# EAGLE schematic DIDV_-_Expansao_05 (EAGLE 6.2)

## Sheet 1 of 2
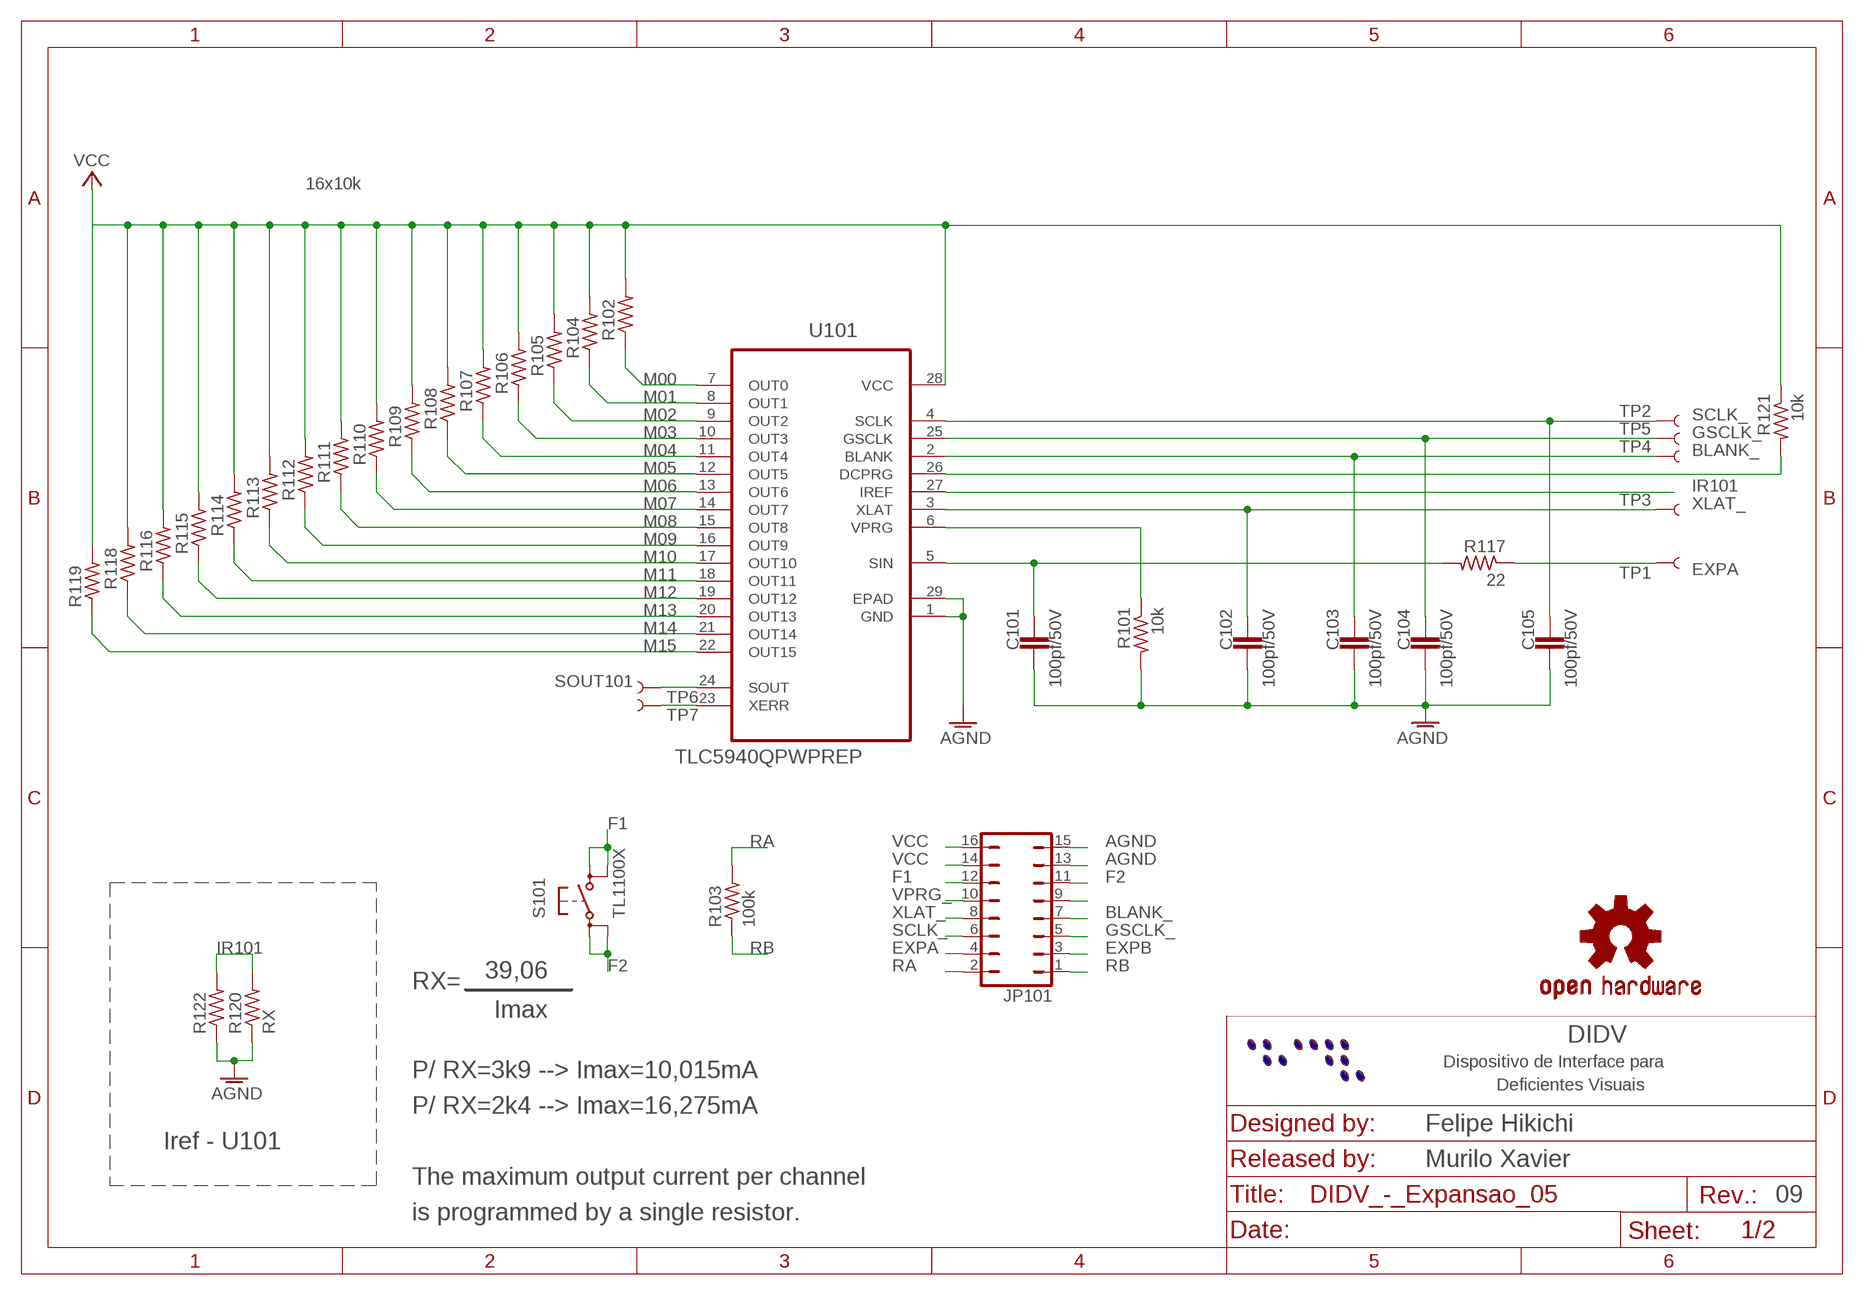
[diagram p0: schematic, sheet 1]

### Parts
C101  100pf/50V  C-EUC0603K  [C0603K]
C102  100pf/50V  C-EUC0603K  [C0603K]
C103  100pf/50V  C-EUC0603K  [C0603K]
C104  100pf/50V  C-EUC0603K  [C0603K]
C105  100pf/50V  C-EUC0603K  [C0603K]
JP101  JP8Q  [JP8Q]
LOGO101  OSHW-LOGOM  [OSHW-LOGO-M]
R101  10k  R-US_R0603  [R0603]
R102  R-US_R0805  [R0805]
R103  100k  R-US_R0805  [R0805]
R104  R-US_R0805  [R0805]
R105  R-US_R0805  [R0805]
R106  R-US_R0805  [R0805]
R107  R-US_R0805  [R0805]
R108  R-US_R0805  [R0805]
R109  R-US_R0805  [R0805]
R110  R-US_R0805  [R0805]
R111  R-US_R0805  [R0805]
R112  R-US_R0805  [R0805]
R113  R-US_R0805  [R0805]
R114  R-US_R0805  [R0805]
R115  R-US_R0805  [R0805]
R116  R-US_R0805  [R0805]
R117  22  R-US_R0603  [R0603]
R118  R-US_R0805  [R0805]
R119  R-US_R0805  [R0805]
R120  RX  R-US_R0805  [R0805]
R121  10k  R-US_R0603  [R0603]
R122  R-US_R0805  [R0805]
S101  TL1100X  [TL1100X]
TP1  TEST-POINT3X4  [PAD.03X.04]
TP2  TEST-POINT3X4  [PAD.03X.04]
TP3  TEST-POINT3X4  [PAD.03X.04]
TP4  TEST-POINT3X4  [PAD.03X.04]
TP5  TEST-POINT3X4  [PAD.03X.04]
TP6  TEST-POINT3X4  [PAD.03X.04]
TP7  TEST-POINT3X4  [PAD.03X.04]
U101  TLC5940QPWPREP  [SOP65P640X120-29N]

### Nets
AGND: C101.1 C102.1 C103.1 C104.1 C105.1 JP101.13 JP101.15 R101.2 R120.1 R122.1 U101.1(GND) U101.29(EPAD) ; also sheet 2
BLANK_: C103.2 JP101.7 TP4.P$1 U101.2(BLANK) ; also sheet 2
EXPA: JP101.4 R117.1 TP1.P$1
EXPB: JP101.3 ; also sheet 2
F1: JP101.12 S101.3(S) S101.4(S1)
F2: JP101.11 S101.1(P) S101.2(P1)
GSCLK_: C104.2 JP101.5 TP5.P$1 U101.25(GSCLK) ; also sheet 2
IR101: R120.2 R122.2 U101.27(IREF)
M00: R102.1 U101.7(OUT0) ; also sheet 2
M01: R104.1 U101.8(OUT1) ; also sheet 2
M02: R105.1 U101.9(OUT2) ; also sheet 2
M03: R106.1 U101.10(OUT3) ; also sheet 2
M04: R107.1 U101.11(OUT4) ; also sheet 2
M05: R108.1 U101.12(OUT5) ; also sheet 2
M06: R109.1 U101.13(OUT6) ; also sheet 2
M07: R110.1 U101.14(OUT7) ; also sheet 2
M08: R111.1 U101.15(OUT8) ; also sheet 2
M09: R112.1 U101.16(OUT9) ; also sheet 2
M10: R113.1 U101.17(OUT10) ; also sheet 2
M11: R114.1 U101.18(OUT11) ; also sheet 2
M12: R115.1 U101.19(OUT12) ; also sheet 2
M13: R116.1 U101.20(OUT13) ; also sheet 2
M14: R118.1 U101.21(OUT14) ; also sheet 2
M15: R119.1 U101.22(OUT15) ; also sheet 2
N$2: JP101.9
N$4: C101.2 R117.2 U101.5(SIN)
N$10: TP7.P$1 U101.23(XERR)
N$22: R121.2 U101.26(DCPRG)
RA: JP101.2 R103.2
RB: JP101.1 R103.1
SCLK_: C105.2 JP101.6 TP2.P$1 U101.4(SCLK) ; also sheet 2
SOUT101: TP6.P$1 U101.24(SOUT) ; also sheet 2
VCC: JP101.14 JP101.16 R102.2 R104.2 R105.2 R106.2 R107.2 R108.2 R109.2 R110.2 R111.2 R112.2 R113.2 R114.2 R115.2 R116.2 R118.2 R119.2 R121.1 U101.28(VCC) ; also sheet 2
VPRG_: JP101.10 R101.1 U101.6(VPRG) ; also sheet 2
XLAT_: C102.2 JP101.8 TP3.P$1 U101.3(XLAT) ; also sheet 2

### Notes on the sheet
- 16x10k
- 39,06
- RX=
- Imax
- DIDV
- Dispositivo de Interface para
- P/ RX=3k9 --> Imax=10,015mA
- Deficientes Visuais
- P/ RX=2k4 --> Imax=16,275mA
- Felipe Hikichi
- Iref - U101
- Murilo Xavier
- The maximum output current per channel
- 09
- is programmed by a single resistor.

## Sheet 2 of 2
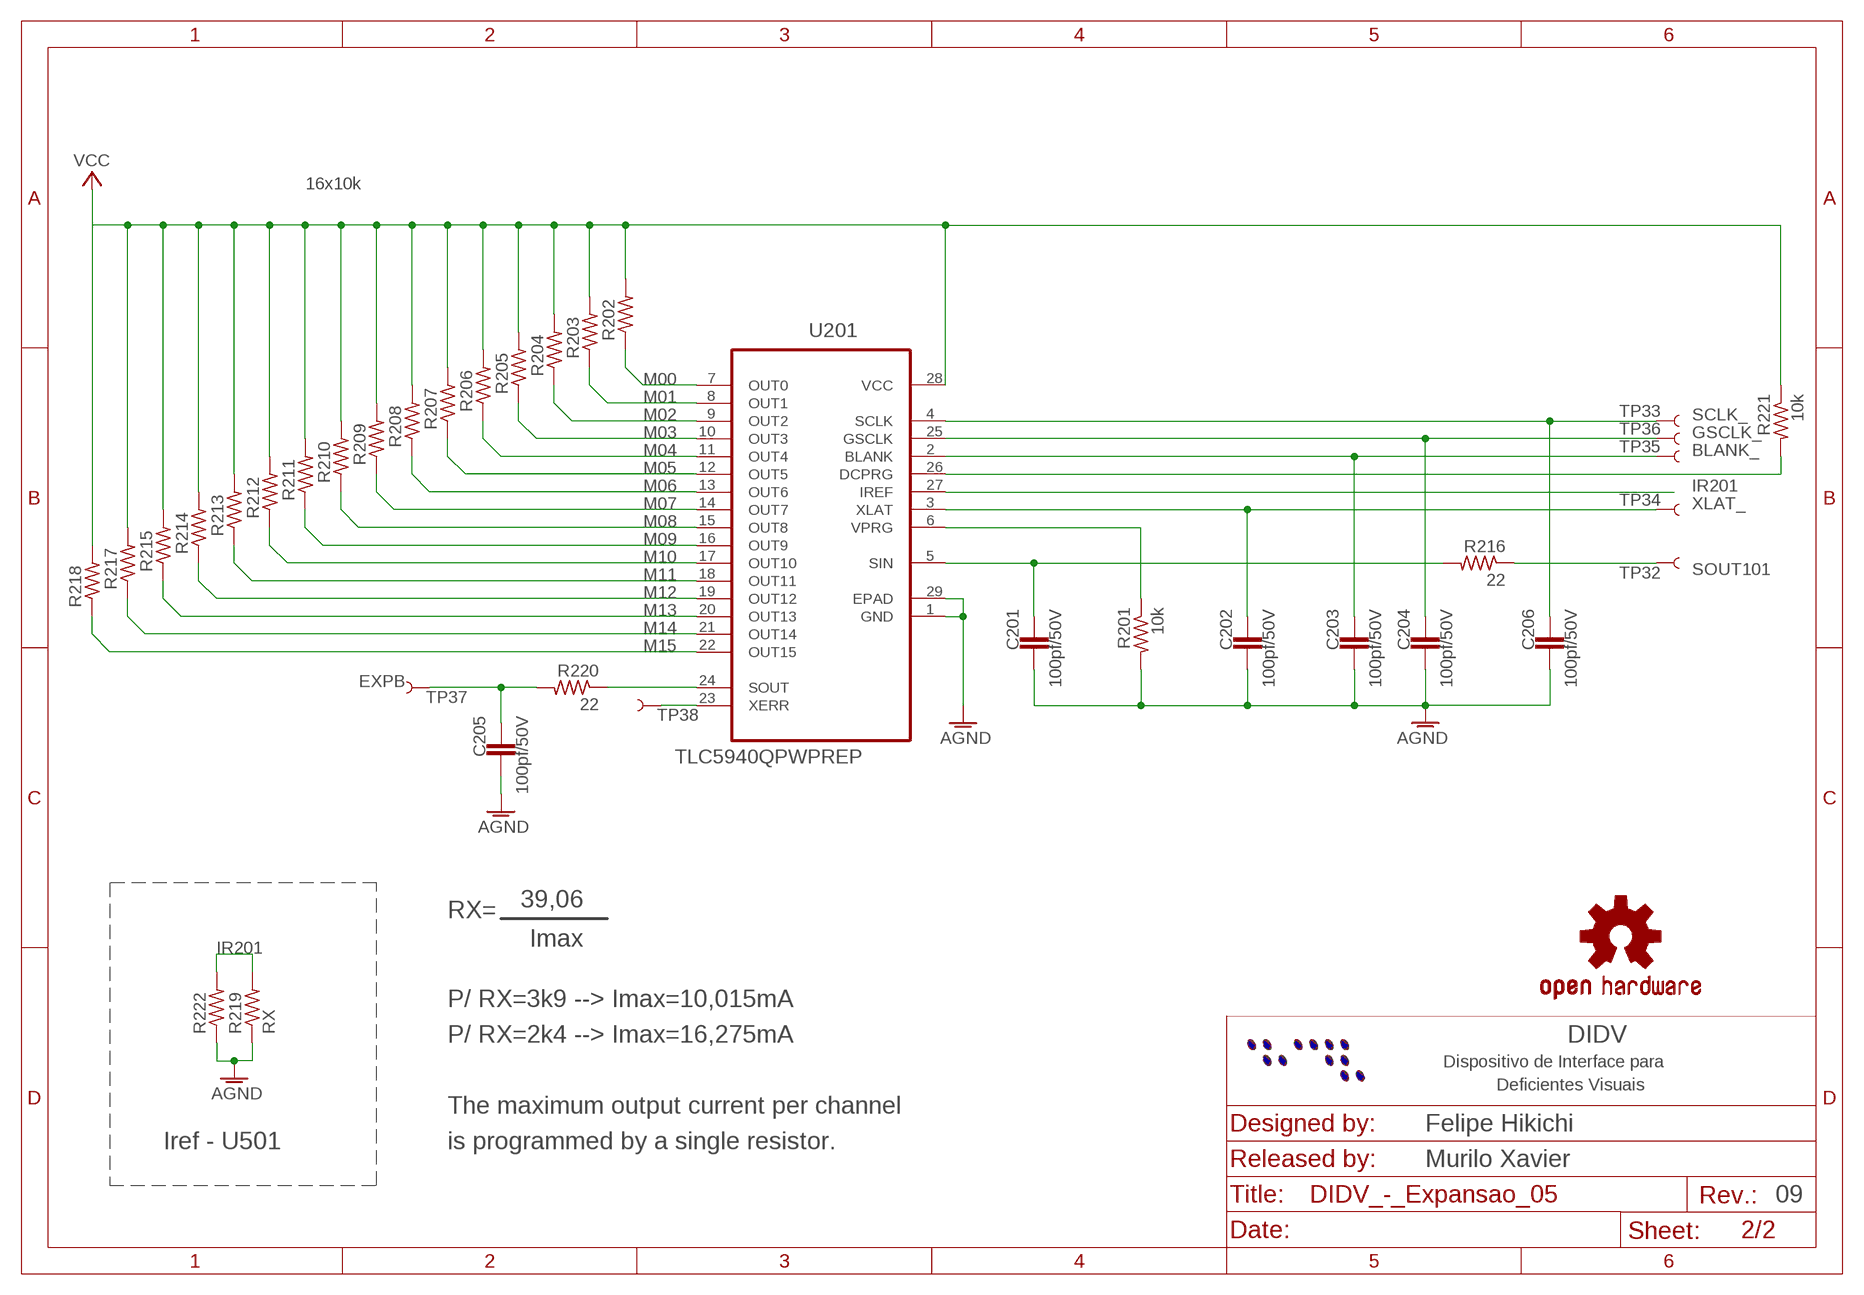
[diagram p1: schematic, sheet 2]

### Parts
C201  100pf/50V  C-EUC0603K  [C0603K]
C202  100pf/50V  C-EUC0603K  [C0603K]
C203  100pf/50V  C-EUC0603K  [C0603K]
C204  100pf/50V  C-EUC0603K  [C0603K]
C205  100pf/50V  C-EUC0603K  [C0603K]
C206  100pf/50V  C-EUC0603K  [C0603K]
LOGO201  OSHW-LOGOM  [OSHW-LOGO-M]
R201  10k  R-US_R0603  [R0603]
R202  R-US_R0805  [R0805]
R203  R-US_R0805  [R0805]
R204  R-US_R0805  [R0805]
R205  R-US_R0805  [R0805]
R206  R-US_R0805  [R0805]
R207  R-US_R0805  [R0805]
R208  R-US_R0805  [R0805]
R209  R-US_R0805  [R0805]
R210  R-US_R0805  [R0805]
R211  R-US_R0805  [R0805]
R212  R-US_R0805  [R0805]
R213  R-US_R0805  [R0805]
R214  R-US_R0805  [R0805]
R215  R-US_R0805  [R0805]
R216  22  R-US_R0603  [R0603]
R217  R-US_R0805  [R0805]
R218  R-US_R0805  [R0805]
R219  RX  R-US_R0805  [R0805]
R220  22  R-US_R0603  [R0603]
R221  10k  R-US_R0603  [R0603]
R222  R-US_R0805  [R0805]
TP32  TEST-POINT3X4  [PAD.03X.04]
TP33  TEST-POINT3X4  [PAD.03X.04]
TP34  TEST-POINT3X4  [PAD.03X.04]
TP35  TEST-POINT3X4  [PAD.03X.04]
TP36  TEST-POINT3X4  [PAD.03X.04]
TP37  TEST-POINT3X4  [PAD.03X.04]
TP38  TEST-POINT3X4  [PAD.03X.04]
U201  TLC5940QPWPREP  [SOP65P640X120-29N]

### Nets
AGND: C201.1 C202.1 C203.1 C204.1 C205.1 C206.1 R201.2 R219.1 R222.1 U201.1(GND) U201.29(EPAD) ; also sheet 1
BLANK_: C203.2 TP35.P$1 U201.2(BLANK) ; also sheet 1
EXPB: C205.2 R220.2 TP37.P$1 ; also sheet 1
GSCLK_: C204.2 TP36.P$1 U201.25(GSCLK) ; also sheet 1
IR201: R219.2 R222.2 U201.27(IREF)
M00: R202.1 U201.7(OUT0) ; also sheet 1
M01: R203.1 U201.8(OUT1) ; also sheet 1
M02: R204.1 U201.9(OUT2) ; also sheet 1
M03: R205.1 U201.10(OUT3) ; also sheet 1
M04: R206.1 U201.11(OUT4) ; also sheet 1
M05: R207.1 U201.12(OUT5) ; also sheet 1
M06: R208.1 U201.13(OUT6) ; also sheet 1
M07: R209.1 U201.14(OUT7) ; also sheet 1
M08: R210.1 U201.15(OUT8) ; also sheet 1
M09: R211.1 U201.16(OUT9) ; also sheet 1
M10: R212.1 U201.17(OUT10) ; also sheet 1
M11: R213.1 U201.18(OUT11) ; also sheet 1
M12: R214.1 U201.19(OUT12) ; also sheet 1
M13: R215.1 U201.20(OUT13) ; also sheet 1
M14: R217.1 U201.21(OUT14) ; also sheet 1
M15: R218.1 U201.22(OUT15) ; also sheet 1
N$39: C201.2 R216.2 U201.5(SIN)
N$40: TP38.P$1 U201.23(XERR)
N$69: R221.2 U201.26(DCPRG)
N$71: R220.1 U201.24(SOUT)
SCLK_: C206.2 TP33.P$1 U201.4(SCLK) ; also sheet 1
SOUT101: R216.1 TP32.P$1 ; also sheet 1
VCC: R202.2 R203.2 R204.2 R205.2 R206.2 R207.2 R208.2 R209.2 R210.2 R211.2 R212.2 R213.2 R214.2 R215.2 R217.2 R218.2 R221.1 U201.28(VCC) ; also sheet 1
VPRG_: R201.1 U201.6(VPRG) ; also sheet 1
XLAT_: C202.2 TP34.P$1 U201.3(XLAT) ; also sheet 1

### Notes on the sheet
- 16x10k
- 39,06
- RX=
- Imax
- P/ RX=3k9 --> Imax=10,015mA
- P/ RX=2k4 --> Imax=16,275mA | DIDV
- Dispositivo de Interface para
- Deficientes Visuais
- The maximum output current per channel
- Felipe Hikichi
- Iref - U501 | is programmed by a single resistor.
- Murilo Xavier
- 09

## Library data of the parts
C101-C105 C201-C206 = rcl:C-EU: CAPACITOR, European symbol
JP101 = jumper:JP8Q: JUMPER
LOGO101 LOGO201 = SparkFun-Aesthetics:OSHW-LOGO: Open Source Hardware Logo This logo indicates the piece of hardware it is found on incorporates a OSHW license and/or adheres to the definition of open source hardware found here: http://freedomdefined.org/OSHW
R101-R122 R201-R222 = rcl:R-US_: RESISTOR, American symbol
S101 = switch-e-switch:TL1100X: TACTILE SWITCH
TP1-TP7 TP32-TP38 = SparkFun-Passives:TEST-POINT: Bare copper test points for troubleshooting or ICT
U101 U201 = Texas Instruments_By_element14_Batch_1:TLC5940QPWPREP: 16-CHANNEL LED DRIVER; MPN: TLC5940QPWPREP; OC_FARNELL: -; OC_NEWARK: 79R8509; PACKAGE: TSSOP-28; SUPPLIER: Texas Instruments